# EAGLE design sheep (EAGLE 5.06)
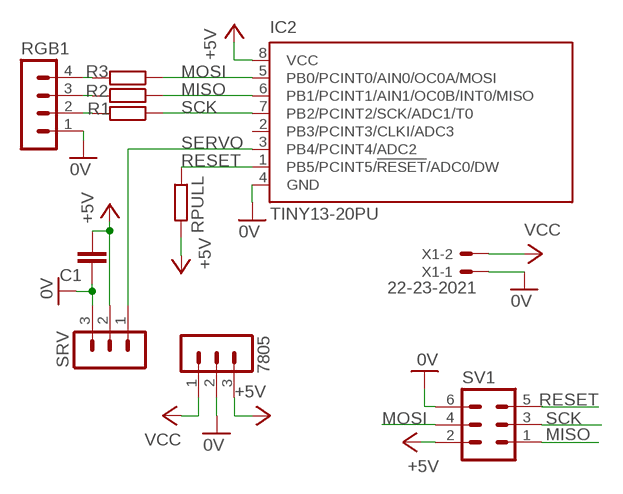
[diagram p0: schematic, sheet 1]

## Parts
7805  MA03-1  [MA03-1]
C1  C-EU050-024X044  [C050-024X044]
IC2  TINY13-20PU  [DIL08]
R1  R-EU_0207/7  [0207/7]
R2  R-EU_0207/7  [0207/7]
R3  R-EU_0207/7  [0207/7]
RGB1  MA04-1  [MA04-1]
RPULL  R-EU_0207/7  [0207/7]
SRV  MA03-1  [MA03-1]
SV1  MA03-2  [MA03-2]
X1  22-23-2021  [22-23-2021]

## Nets
0V: 7805.2 C1.1 IC2.4(GND) RGB1.1 SRV.3 SV1.6 X1.1
+5V: 7805.3 C1.2 IC2.8(VCC) RPULL.2 SRV.2 SV1.2
MISO: IC2.6(PB1/PCINT1/AIN1/OC0B/INT0/MISO) R2.1 SV1.1
MOSI: IC2.5(PB0/PCINT0/AIN0/OC0A/MOSI) R3.1 SV1.4
N$1: R3.2 RGB1.4
N$2: R2.2 RGB1.3
N$3: R1.2 RGB1.2
RESET: IC2.1(PB5/PCINT5/!RESET!/ADC0/DW) RPULL.1 SV1.5
SCK: IC2.7(PB2/PCINT2/SCK/ADC1/T0) R1.1 SV1.3
SERVO: IC2.3(PB4/PCINT4/ADC2) SRV.1
VCC: 7805.1 X1.2
Unconnected: IC2.2(PB3/PCINT3/CLKI/ADC3)

## Library data of the parts
7805 SRV = con-lstb:MA03-1: PIN HEADER
C1 = rcl:C-EU: CAPACITOR, European symbol
IC2 = atmel:TINY13: 8-bit AVR Microcontroller with 1K Bytes In-System Programmable Flash Source: http://www.atmel.com/dyn/resources/prod_documents/2535S.pdf
R1-R3 RPULL = rcl:R-EU_: RESISTOR, European symbol
RGB1 = con-lstb:MA04-1: PIN HEADER
SV1 = con-lstb:MA03-2: PIN HEADER
X1 = con-molex:22-23-2021: .100" (2.54mm) Center Header - 2 Pin

## Board
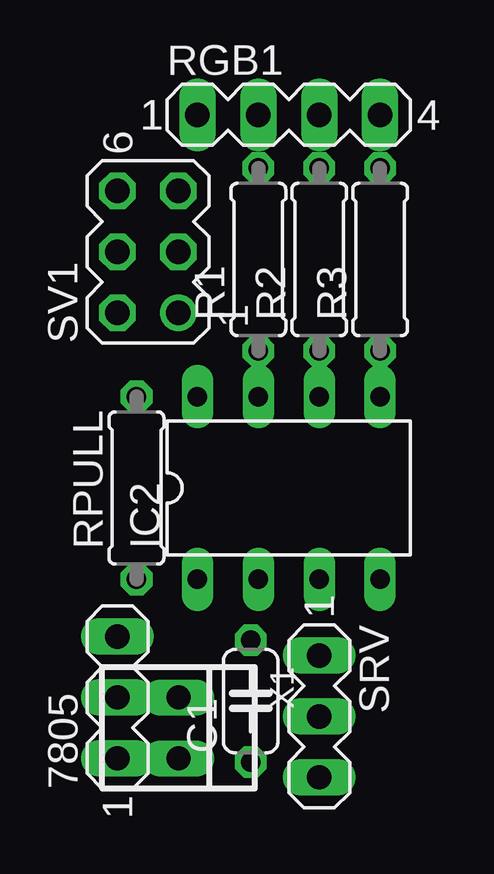
[diagram p1: board, top side]
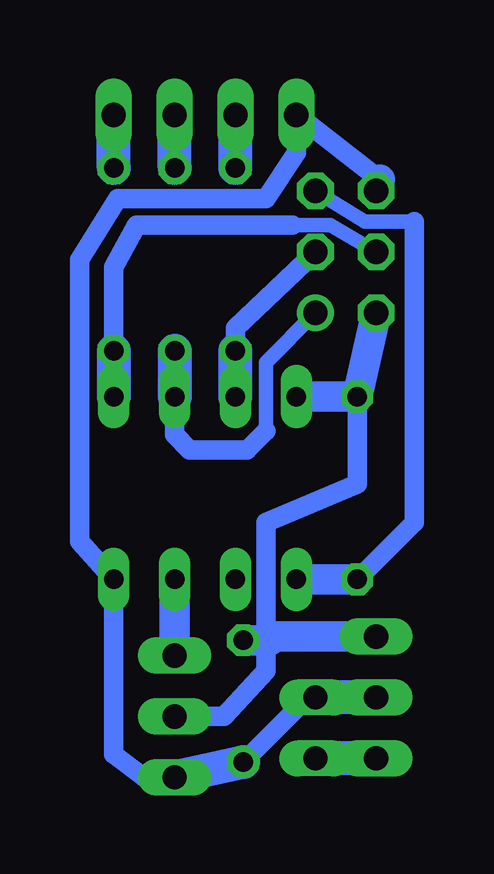
[diagram p2: board, bottom side, seen from below]

No outline drawn. Coordinates in mm, seen from the top.
Copper layers (1*16): Top 0.035mm / dielectric 1.5mm / Bottom 0.035mm
Design rules "default": minimum track width 10mil, minimum drill 24mil, track to track 8mil, track to pad 8mil, pad to pad 8mil, via to via 8mil, smd to smd 8mil, copper to edge 40mil, drill to drill 8mil, minimum pad ring 10mil, minimum via ring 8mil, stop-mask expansion 4mil, vias tented up to drill 0mil, thermal gap 10mil

### Footprints (pad centres in the part's own frame; a part is rotated, then mirrored left to right if it is on the bottom)
MA03-1 = drill 1.016 long: 1 -2.54,0; 2 0,0; 3 2.54,0
C050-024X044 = drill 0.813 octagon: 1 -2.54,0; 2 2.54,0
DIL08 = drill 0.813 long: 1 -3.81,-3.81; 2 -1.27,-3.81; 3 1.27,-3.81; 4 3.81,-3.81; 5 3.81,3.81; 6 1.27,3.81; 7 -1.27,3.81; 8 -3.81,3.81
0207/7 = drill 0.813 octagon: 1 -3.81,0; 2 3.81,0
MA04-1 = drill 1.016 long: 1 -3.81,0; 2 -1.27,0; 3 1.27,0; 4 3.81,0
MA03-2 = drill 1.016 round: 1 -2.54,-1.27 | drill 1.016 octagon: 2 -2.54,1.27; 3 0,-1.27; 4 0,1.27; 5 2.54,-1.27; 6 2.54,1.27
22-23-2021 = drill 1 long: 1 -1.27,0; 2 1.27,0

### Placement (x,y rotation side)
7805  2.38,4.13 90 top
C1  7.94,3.97 90 top
IC2  9.52,12.86 0 top
R1  8.25,22.38 90 top
R2  10.79,22.38 90 top
R3  13.33,22.38 90 top
RGB1  9.52,28.42 0 top
RPULL  3.17,12.86 90 top
SRV  10.79,3.33 270 top
SV1  3.65,22.7 90 top
X1  4.92,2.86 270 top

### Tracks (layer width: path | path; a pad name or v marks a point on that pad's centre or on a via)
0V
  Bottom 0.813: SRV.3 12.06,0.79 13.34,1.75 IC2.4 14.76,10.64 14.76,22.38 13.18,24.92 6.99,24.92 5.71,26.83 RGB1.1 2.22,25.72 | C1.1 5.24,4.13 X1.1
  Bottom 1.016: 7805.2
  Bottom 1.27: 2.22,25.72 SV1.6
  Bottom 1.422: C1.1 SRV.3 | 7805.2 X1.1
+5V
  Bottom 0.813: SRV.2 8.73,3.33 6.99,5.24 6.99,6.67 | 6.99,6.67 6.83,6.67 6.83,6.51 | RPULL.2 3.17,14.13 3.17,13.02 6.99,11.43 6.99,6.67
  Bottom 1.27: IC2.8 RPULL.2 SV1.2 | 7805.3 6.83,6.67 | 6.83,6.51 C1.2
MISO
  Bottom 0.61: 6.99,15.24 6.99,18.1 SV1.1
  Bottom 0.813: R2.1 10.79,15.08 10.16,14.45 7.78,14.45 6.99,15.24
  Bottom 1.422: R2.1 IC2.6
MOSI
  Bottom 0.61: SV1.4 4.29,23.81 5.87,23.81
  Bottom 0.813: 5.87,23.81 12.38,23.81 13.34,22.07 R3.1
  Bottom 1.422: R3.1 IC2.5
N$1
  Bottom 1.422: R3.2 RGB1.4
N$2
  Bottom 1.422: R2.2 RGB1.3
N$3
  Bottom 1.422: R1.2 RGB1.2
RESET
  Bottom 0.61: SV1.5 2.86,23.97 0.79,23.97
  Bottom 0.813: 0.79,23.97 0.79,11.43 RPULL.1
  Bottom 1.27: RPULL.1 IC2.1
SCK
  Bottom 0.813: R1.1 8.26,19.53 SV1.3
  Bottom 1.422: IC2.7 R1.1
SERVO
  Bottom 1.27: SRV.1 IC2.3
VCC
  Bottom 1.016: X1.2
  Bottom 1.422: 7805.1 X1.2